# Altium schematic sheet 014_SoC GPIO 1.8V & Bootstrap.SchDoc
size 420 x 297 mm; Page Create Date: May 29, 2006; WebSite: https://www.seeedstudio.com; Page Number: 14; Drawing: qxn; Schematic Name: BeaglePlay; Page Size: A3; Comment: Seeed Title; Page Count: 22; Page Name: 014_SoC GPIO 1.8V & Bootstrap; Company: Seeed Studio; RevCode: v0.2; DsnPath: C:\Users\a0488739\Documents\GitHub\beagleplay\allegro\DVT\BEAGLEPLAYV020_220915.DSN; SchematicName: BeaglePlay; PageName: 014_SoC GPIO 1.8V & Bootstrap; PageSize: A3; TopSchematic: True
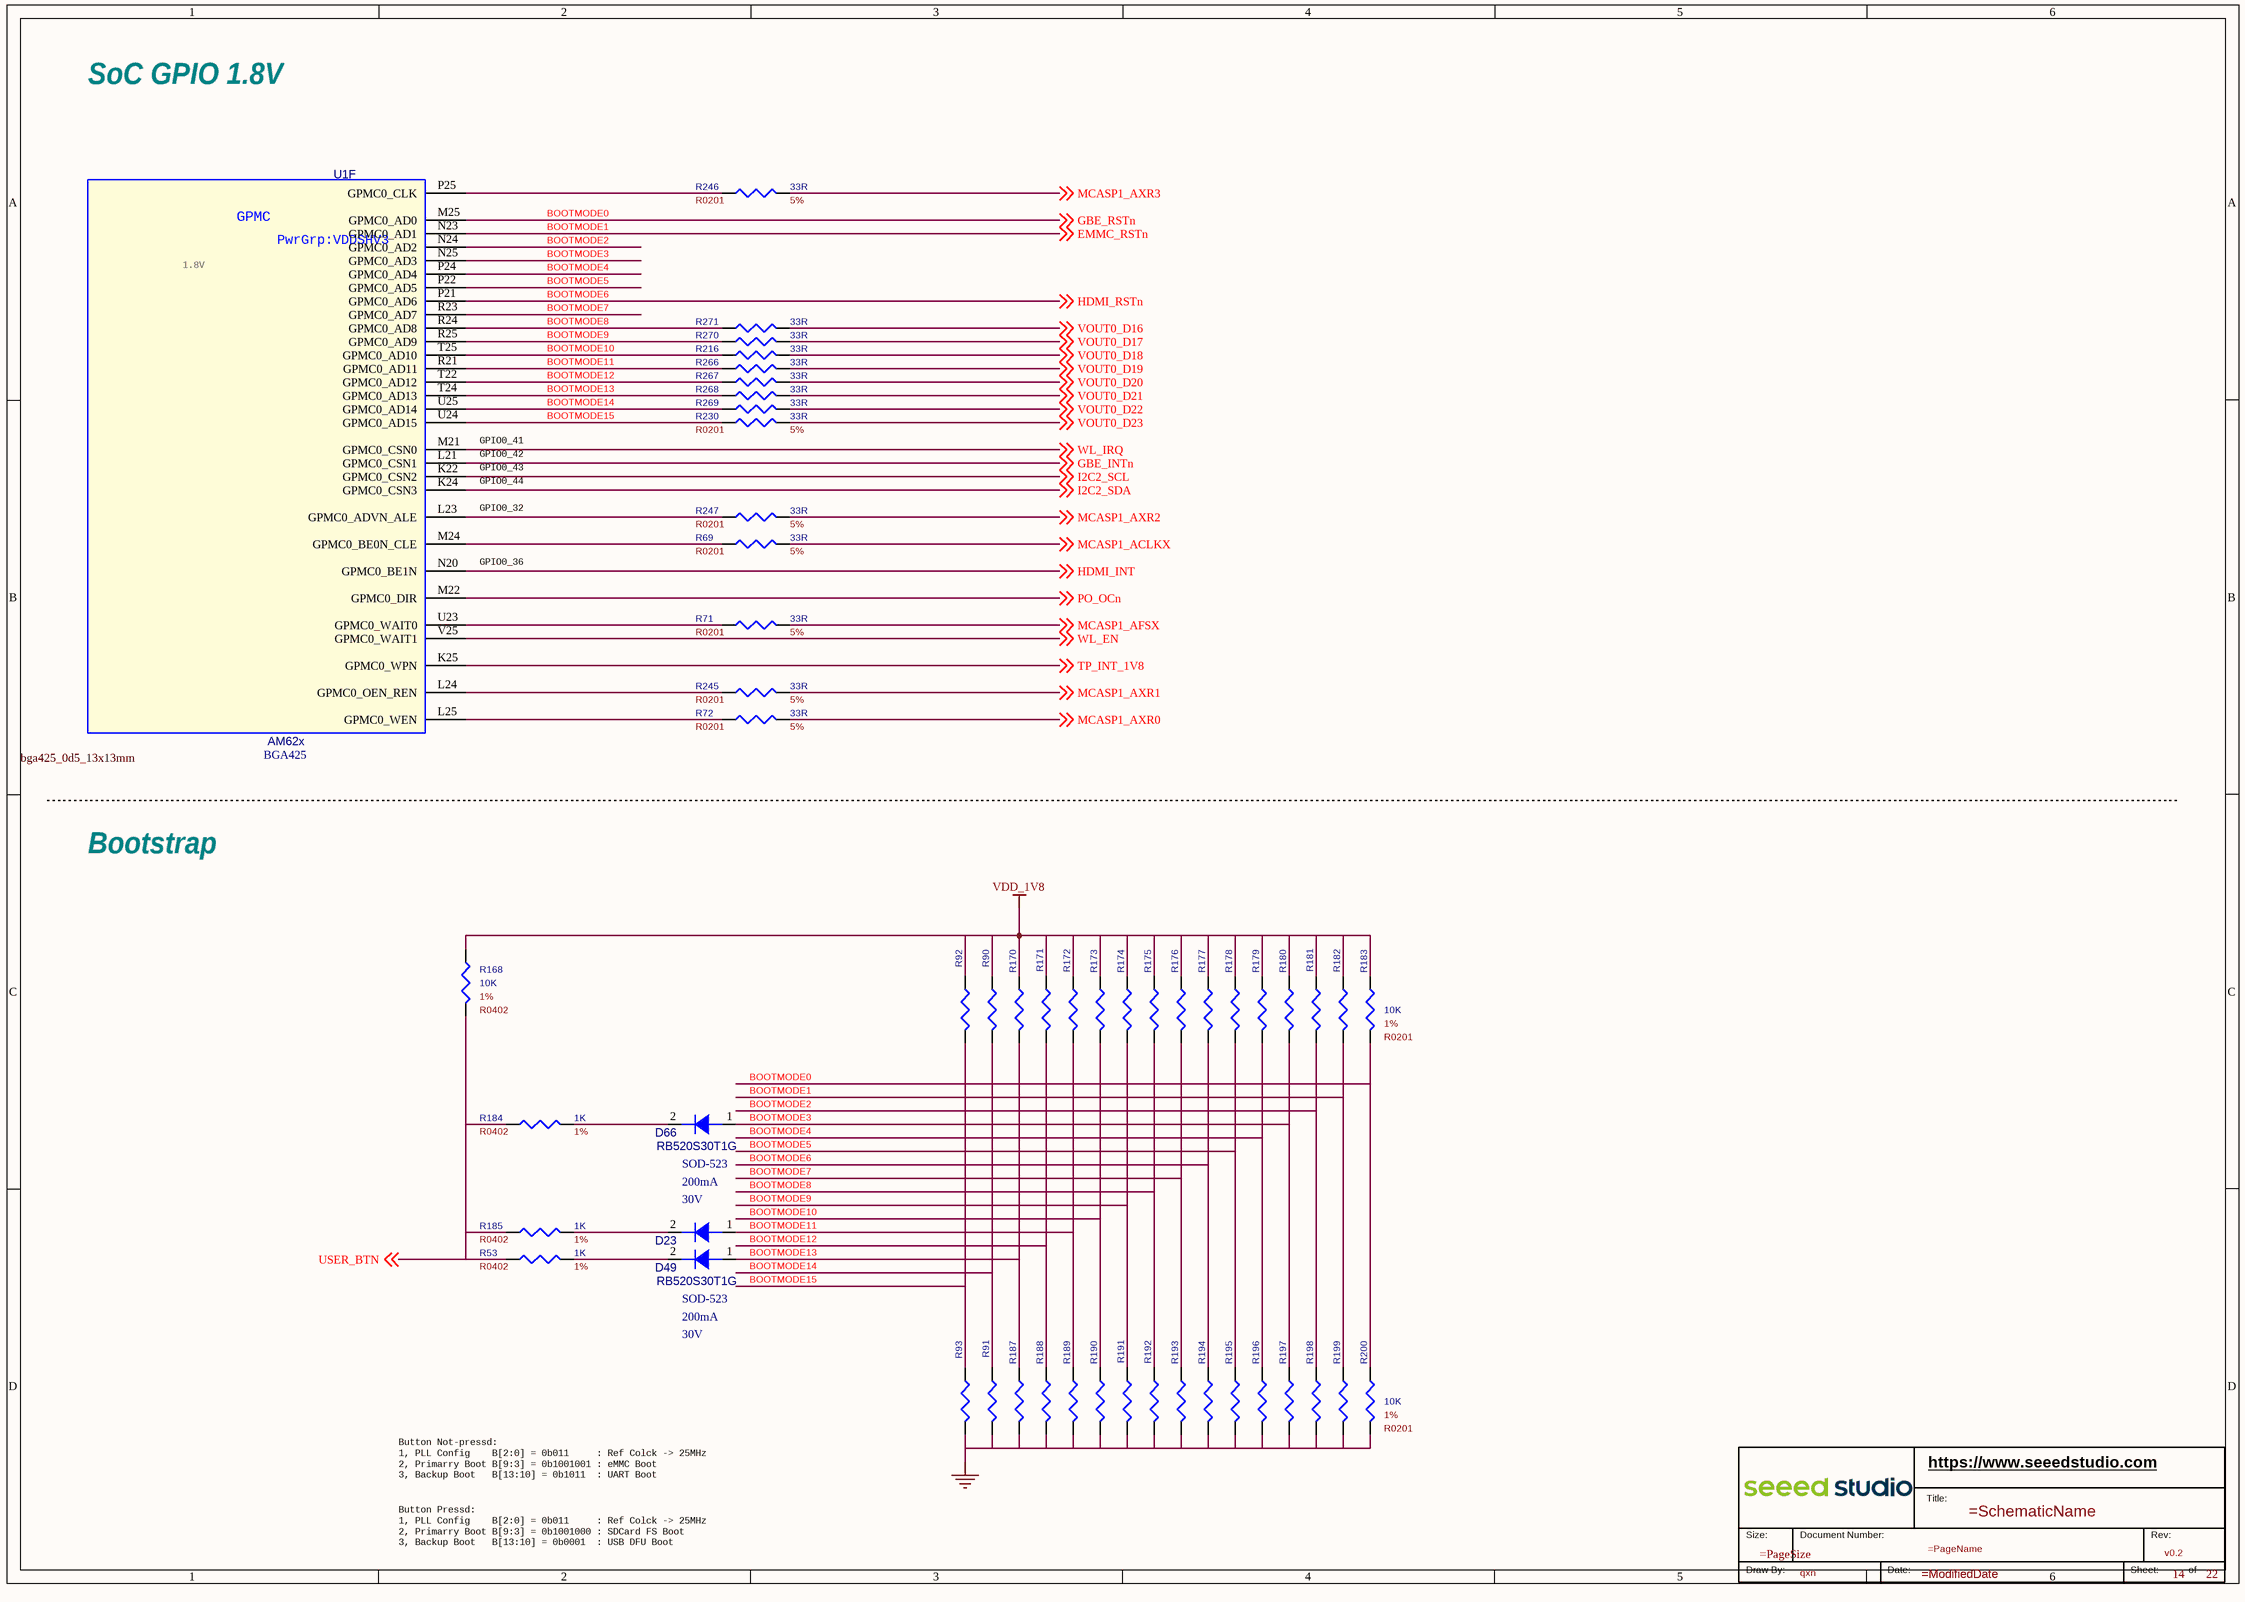
[diagram p0: 014_SoC GPIO 1.8V & Bootstrap.SchDoc]

## Parts
*  RevCode: v0.2  Page Number: 14  Page Count: 22  Drawing: qxn  (hidden comment: Seeed Title)  (graphical)
D23  D  [sod_523]  (value not drawn)
D49  value RB520S30T1G  Repetitive Reverse Voltage Maximum: 30V  Peak Forward Current: 200mA  Package Size: SOD-523  [sod_523]  (hidden comment: D)
D66  value RB520S30T1G  Repetitive Reverse Voltage Maximum: 30V  Peak Forward Current: 200mA  Package Size: SOD-523  [sod_523]  (hidden comment: D)
R53  value 1K  Rating: 1%  [R0402]  (hidden comment: R)
R69  value 33R  Rating: 5%  [R0201]  (hidden comment: R)
R71  value 33R  Rating: 5%  [R0201]  (hidden comment: R)
R72  value 33R  Rating: 5%  [R0201]  (hidden comment: R)
R90  R  [R0201]  (value not drawn)
R91  R  [R0201]  (value not drawn)
R92  R  [R0201]  (value not drawn)
R93  R  [R0201]  (value not drawn)
R168  value 10K  Rating: 1%  [R0402]  (hidden comment: R)
R170  R  [R0201]  (value not drawn)
R171  R  [R0201]  (value not drawn)
R172  R  [R0201]  (value not drawn)
R173  R  [R0201]  (value not drawn)
R174  R  [R0201]  (value not drawn)
R175  R  [R0201]  (value not drawn)
R176  R  [R0201]  (value not drawn)
R177  R  [R0201]  (value not drawn)
R178  R  [R0201]  (value not drawn)
R179  R  [R0201]  (value not drawn)
R180  R  [R0201]  (value not drawn)
R181  R  [R0201]  (value not drawn)
R182  R  [R0201]  (value not drawn)
R183  value 10K  Rating: 1%  [R0201]  (hidden comment: R)
R184  value 1K  Rating: 1%  [R0402]  (hidden comment: R)
R185  value 1K  Rating: 1%  [R0402]  (hidden comment: R)
R187  R  [R0201]  (value not drawn)
R188  R  [R0201]  (value not drawn)
R189  R  [R0201]  (value not drawn)
R190  R  [R0201]  (value not drawn)
R191  R  [R0201]  (value not drawn)
R192  R  [R0201]  (value not drawn)
R193  R  [R0201]  (value not drawn)
R194  R  [R0201]  (value not drawn)
R195  R  [R0201]  (value not drawn)
R196  R  [R0201]  (value not drawn)
R197  R  [R0201]  (value not drawn)
R198  R  [R0201]  (value not drawn)
R199  R  [R0201]  (value not drawn)
R200  value 10K  Rating: 1%  [R0201]  (hidden comment: R)
R216  value 33R  [R0201]  (hidden comment: R)
R230  value 33R  Rating: 5%  [R0201]  (hidden comment: R)
R245  value 33R  Rating: 5%  [R0201]  (hidden comment: R)
R246  value 33R  Rating: 5%  [R0201]  (hidden comment: R)
R247  value 33R  Rating: 5%  [R0201]  (hidden comment: R)
R266  value 33R  [R0201]  (hidden comment: R)
R267  value 33R  [R0201]  (hidden comment: R)
R268  value 33R  [R0201]  (hidden comment: R)
R269  value 33R  [R0201]  (hidden comment: R)
R270  value 33R  [R0201]  (hidden comment: R)
R271  value 33R  [R0201]  (hidden comment: R)
U1  value AM62x  Package Size: BGA425  [bga425_0d5_13x13mm]  (hidden comment: AM62x_BGA425)  (part F of 19)

## Nets
GND: R91.2 R93.2 R187.2 R188.2 R189.2 R190.2 R191.2 R192.2 R193.2 R194.2 R195.2 R196.2 R197.2 R198.2 R199.2 R200.2
VDD_1V8: R90.1 R92.1 R168.1 R170.1 R171.1 R172.1 R173.1 R174.1 R175.1 R176.1 R177.1 R178.1 R179.1 R180.1 R181.1 R182.1 R183.1
BOOTMODE0: R183.2 R200.1 U1.M25(GPMC0_AD0) ; off-sheet GBE_RSTn  [also labelled GBE_RSTn]
BOOTMODE1: R182.2 R199.1 U1.N23(GPMC0_AD1) ; off-sheet EMMC_RSTn  [also labelled EMMC_RSTn]
BOOTMODE2: R181.2 R198.1 U1.N24(GPMC0_AD2)
BOOTMODE3: D66.1(A) R180.2 R197.1 U1.N25(GPMC0_AD3)
BOOTMODE4: R179.2 R196.1 U1.P24(GPMC0_AD4)
BOOTMODE5: R178.2 R195.1 U1.P22(GPMC0_AD5)
BOOTMODE6: R177.2 R194.1 U1.P21(GPMC0_AD6) ; off-sheet HDMI_RSTn  [also labelled HDMI_RSTn]
BOOTMODE7: R176.2 R193.1 U1.R23(GPMC0_AD7)
BOOTMODE8: R175.2 R192.1 R271.1 U1.R24(GPMC0_AD8)
BOOTMODE9: R174.2 R191.1 R270.1 U1.R25(GPMC0_AD9)
BOOTMODE10: R173.2 R190.1 R216.1 U1.T25(GPMC0_AD10)
BOOTMODE11: D23.1(A) R172.2 R189.1 R266.1 U1.R21(GPMC0_AD11)
BOOTMODE12: R171.2 R188.1 R267.1 U1.T22(GPMC0_AD12)
BOOTMODE13: D49.1(A) R170.2 R187.1 R268.1 U1.T24(GPMC0_AD13)
BOOTMODE14: R90.2 R91.1 R269.1 U1.U25(GPMC0_AD14)
BOOTMODE15: R92.2 R93.1 R230.1 U1.U24(GPMC0_AD15)
GBE_INTn: U1.L21(GPMC0_CSN1) ; off-sheet GBE_INTn
HDMI_INT: U1.N20(GPMC0_BE1N) ; off-sheet HDMI_INT
I2C2_SCL: U1.K22(GPMC0_CSN2) ; off-sheet I2C2_SCL
I2C2_SDA: U1.K24(GPMC0_CSN3) ; off-sheet I2C2_SDA
MCASP1_ACLKX: R69.2 ; off-sheet MCASP1_ACLKX
MCASP1_AFSX: R71.2 ; off-sheet MCASP1_AFSX
MCASP1_AXR0: R72.2 ; off-sheet MCASP1_AXR0
MCASP1_AXR1: R245.2 ; off-sheet MCASP1_AXR1
MCASP1_AXR2: R247.2 ; off-sheet MCASP1_AXR2
MCASP1_AXR3: R246.2 ; off-sheet MCASP1_AXR3
PO_OCn: U1.M22(GPMC0_DIR) ; off-sheet PO_OCn
TP_INT_1V8: U1.K25(GPMC0_WPN) ; off-sheet TP_INT_1V8
USER_BTN: R53.1 R168.2 R184.1 R185.1 ; off-sheet USER_BTN
VOUT0_D16: R271.2 ; off-sheet VOUT0_D16
VOUT0_D17: R270.2 ; off-sheet VOUT0_D17
VOUT0_D18: R216.2 ; off-sheet VOUT0_D18
VOUT0_D19: R266.2 ; off-sheet VOUT0_D19
VOUT0_D20: R267.2 ; off-sheet VOUT0_D20
VOUT0_D21: R268.2 ; off-sheet VOUT0_D21
VOUT0_D22: R269.2 ; off-sheet VOUT0_D22
VOUT0_D23: R230.2 ; off-sheet VOUT0_D23
WL_EN: U1.V25(GPMC0_WAIT1) ; off-sheet WL_EN
WL_IRQ: U1.M21(GPMC0_CSN0) ; off-sheet WL_IRQ
NetD23_2: D23.2(C) R185.2
NetD49_2: D49.2(C) R53.2
NetD66_2: D66.2(C) R184.2
NetR69_1: R69.1 U1.M24(GPMC0_BE0N_CLE)
NetR71_1: R71.1 U1.U23(GPMC0_WAIT0)
NetR72_1: R72.1 U1.L25(GPMC0_WEN)
NetR245_1: R245.1 U1.L24(GPMC0_OEN_REN)
NetR246_1: R246.1 U1.P25(GPMC0_CLK)
NetR247_1: R247.1 U1.L23(GPMC0_ADVN_ALE)

## Notes on the sheet
- SoC GPIO 1.8V
- 1.8V
- GPIO0_42
- GPIO0_41
- GPIO0_43
- GPIO0_44
- GPIO0_32
- GPIO0_36
- Bootstrap
- Button Not-pressd:
  1, PLL Config    B[2:0] = 0b011     : Ref Colck -> 25MHz
  2, Primarry Boot B[9:3] = 0b1001001 : eMMC Boot
  3, Backup Boot   B[13:10] = 0b1011  : UART Boot
- Button Pressd:
  1, PLL Config    B[2:0] = 0b011     : Ref Colck -> 25MHz
  2, Primarry Boot B[9:3] = 0b1001000 : SDCard FS Boot
  3, Backup Boot   B[13:10] = 0b0001  : USB DFU Boot
- (in symbol AM62x_BGA425, part F) GPMC; PwrGrp:VDDSHV3
- (in symbol Seeed Title) https://www.seeedstudio.com; Title:; Size:; Document Number:; Rev:; Draw By:; Date:; Sheet:; of

## Library data of the parts
* = Seeed Title: Company: Seeed Studio; WebSite: https://www.seeedstudio.com; Schematic Name: =SchematicName; Page Size: =PageSize; Page Name: =PageName; Page Create Date: May 29, 2006; Page Modify Date: =ModifiedDate
D23 = D: DIO, Schottky, RB520S30T1G, , , , SOD-523; Part Reference: D23; Company Part Status: SCG Vehicle Device; Manufacturer: ON; PN: 304020782; Peak Forward Current: 200mA; Repetitive Reverse Voltage Maximum: 30V; CLASS: DISCRETE; PCB Footprint: sod_523; Value: RB520S30T1G; Package Size: SOD-523; Manufacturer PN: RB520S30T1G
D49 = D: DIO, Schottky, RB520S30T1G, , , , SOD-523; Part Reference: D49; Manufacturer: ON; Company Part Status: SCG Vehicle Device; CLASS: DISCRETE; PN: 304020782; PCB Footprint: sod_523; Manufacturer PN: RB520S30T1G
D66 = D: DIO, Schottky, RB520S30T1G, , , , SOD-523; Part Reference: D66; Manufacturer: ON; Company Part Status: SCG Vehicle Device; CLASS: DISCRETE; PN: 304020782; PCB Footprint: sod_523; Manufacturer PN: RB520S30T1G
R53 = R: RES, Thick Film, 1K, 1%, 1/16W, SMD, 0402; Part Reference: R53; Manufacturer PN: RC0402FR-071KL; Manufacturer: YAGEO; Company Part Status: Combox Pro; CLASS: DISCRETE; PN: 301010044; PCB Footprint: R0402; Rated Power: 1/16W; Package Size: 0402
R69 = R: RES, Thick Film, 33R, 5%, 1/20W, SMD, 0201; Part Reference: R69; Manufacturer PN: RC0201JR-0733RL; Manufacturer: YAGEO; Company Part Status: BeagleBone Carrier Board; CLASS: DISCRETE; PN: 301010675; PCB Footprint: R0201; Rated Power: 1/20W; Package Size: 0201
R71 = R: RES, Thick Film, 33R, 5%, 1/20W, SMD, 0201; Part Reference: R71; Manufacturer PN: RC0201JR-0733RL; Manufacturer: YAGEO; Company Part Status: BeagleBone Carrier Board; CLASS: DISCRETE; PN: 301010675; PCB Footprint: R0201; Rated Power: 1/20W; Package Size: 0201
R72 = R: RES, Thick Film, 33R, 5%, 1/20W, SMD, 0201; Part Reference: R72; Manufacturer PN: RC0201JR-0733RL; Manufacturer: YAGEO; Company Part Status: BeagleBone Carrier Board; CLASS: DISCRETE; PN: 301010675; PCB Footprint: R0201; Rated Power: 1/20W; Package Size: 0201
R90 = R: RES, Thick Film, 10K, 1%, 1/20W, SMD, 0201; Part Reference: R90; Manufacturer PN: RC0201FR-0710KL; Manufacturer: YAGEO; Company Part Status: RV PI; CLASS: DISCRETE; PN: 301010526; Rating: 1%; PCB Footprint: R0201; Value: 10K; Package Size: 0201; Rated Power: 1/20W
R91 = R: RES, Thick Film, 10K, 1%, 1/20W, SMD, 0201; Part Reference: R91; Company Part Status: RV PI; Manufacturer: YAGEO; Manufacturer PN: RC0201FR-0710KL; PN: 301010526; CLASS: DISCRETE; Rating: 1%; PCB Footprint: R0201; Value: 10K; Package Size: 0201; Rated Power: 1/20W
R92 = R: RES, Thick Film, 10K, 1%, 1/20W, SMD, 0201; Part Reference: R92; Company Part Status: RV PI; Manufacturer: YAGEO; Manufacturer PN: RC0201FR-0710KL; PN: 301010526; CLASS: DISCRETE; Rating: 1%; PCB Footprint: R0201; Value: 10K; Rated Power: 1/20W; Package Size: 0201
R93 = R: RES, Thick Film, 10K, 1%, 1/20W, SMD, 0201; Part Reference: R93; Manufacturer PN: RC0201FR-0710KL; Manufacturer: YAGEO; Company Part Status: RV PI; CLASS: DISCRETE; PN: 301010526; Rating: 1%; PCB Footprint: R0201; Value: 10K; Rated Power: 1/20W; Package Size: 0201
R168 = R: RES, Thick Film, 10K, 1%, 1/16W, SMD, 0402; Part Reference: R168; Company Part Status: BeagleBone Carrier Board; Manufacturer: YAGEO; Manufacturer PN: RC0402FR-0710KL; PN: 301010047; CLASS: DISCRETE; PCB Footprint: R0402; Package Size: 0402; Rated Power: 1/16W
R170 = R: RES, Thick Film, 10K, 1%, 1/20W, SMD, 0201; Part Reference: R170; Manufacturer PN: RC0201FR-0710KL; Manufacturer: YAGEO; Company Part Status: RV PI; CLASS: DISCRETE; PN: 301010526; Rating: 1%; PCB Footprint: R0201; Value: 10K; Package Size: 0201; Rated Power: 1/20W
R171 = R: RES, Thick Film, 10K, 1%, 1/20W, SMD, 0201; Part Reference: R171; Manufacturer PN: RC0201FR-0710KL; Manufacturer: YAGEO; Company Part Status: RV PI; CLASS: DISCRETE; PN: 301010526; Rating: 1%; PCB Footprint: R0201; Value: 10K; Package Size: 0201; Rated Power: 1/20W
R172 = R: RES, Thick Film, 10K, 1%, 1/20W, SMD, 0201; Part Reference: R172; Manufacturer PN: RC0201FR-0710KL; Manufacturer: YAGEO; Company Part Status: RV PI; CLASS: DISCRETE; PN: 301010526; Rating: 1%; PCB Footprint: R0201; Value: 10K; Package Size: 0201; Rated Power: 1/20W
R173 = R: RES, Thick Film, 10K, 1%, 1/20W, SMD, 0201; Part Reference: R173; Manufacturer PN: RC0201FR-0710KL; Manufacturer: YAGEO; Company Part Status: RV PI; CLASS: DISCRETE; PN: 301010526; Rating: 1%; PCB Footprint: R0201; Value: 10K; Package Size: 0201; Rated Power: 1/20W
R174 = R: RES, Thick Film, 10K, 1%, 1/20W, SMD, 0201; Part Reference: R174; Manufacturer PN: RC0201FR-0710KL; Manufacturer: YAGEO; Company Part Status: RV PI; CLASS: DISCRETE; PN: 301010526; Rating: 1%; PCB Footprint: R0201; Value: 10K; Package Size: 0201; Rated Power: 1/20W
R175 = R: RES, Thick Film, 10K, 1%, 1/20W, SMD, 0201; Part Reference: R175; Manufacturer PN: RC0201FR-0710KL; Manufacturer: YAGEO; Company Part Status: RV PI; CLASS: DISCRETE; PN: 301010526; Rating: 1%; PCB Footprint: R0201; Value: 10K; Package Size: 0201; Rated Power: 1/20W
R176 = R: RES, Thick Film, 10K, 1%, 1/20W, SMD, 0201; Part Reference: R176; Manufacturer PN: RC0201FR-0710KL; Manufacturer: YAGEO; Company Part Status: RV PI; CLASS: DISCRETE; PN: 301010526; Rating: 1%; PCB Footprint: R0201; Value: 10K; Package Size: 0201; Rated Power: 1/20W
R177 = R: RES, Thick Film, 10K, 1%, 1/20W, SMD, 0201; Part Reference: R177; Manufacturer PN: RC0201FR-0710KL; Manufacturer: YAGEO; Company Part Status: RV PI; CLASS: DISCRETE; PN: 301010526; Rating: 1%; PCB Footprint: R0201; Value: 10K; Package Size: 0201; Rated Power: 1/20W
R178 = R: RES, Thick Film, 10K, 1%, 1/20W, SMD, 0201; Part Reference: R178; Manufacturer PN: RC0201FR-0710KL; Manufacturer: YAGEO; Company Part Status: RV PI; CLASS: DISCRETE; PN: 301010526; Rating: 1%; PCB Footprint: R0201; Value: 10K; Package Size: 0201; Rated Power: 1/20W
R179 = R: RES, Thick Film, 10K, 1%, 1/20W, SMD, 0201; Part Reference: R179; Manufacturer PN: RC0201FR-0710KL; Manufacturer: YAGEO; Company Part Status: RV PI; CLASS: DISCRETE; PN: 301010526; Rating: 1%; PCB Footprint: R0201; Value: 10K; Package Size: 0201; Rated Power: 1/20W
R180 = R: RES, Thick Film, 10K, 1%, 1/20W, SMD, 0201; Part Reference: R180; Manufacturer PN: RC0201FR-0710KL; Manufacturer: YAGEO; Company Part Status: RV PI; CLASS: DISCRETE; PN: 301010526; Rating: 1%; PCB Footprint: R0201; Value: 10K; Package Size: 0201; Rated Power: 1/20W
R181 = R: RES, Thick Film, 10K, 1%, 1/20W, SMD, 0201; Part Reference: R181; Manufacturer PN: RC0201FR-0710KL; Manufacturer: YAGEO; Company Part Status: RV PI; CLASS: DISCRETE; PN: 301010526; Rating: 1%; PCB Footprint: R0201; Value: 10K; Package Size: 0201; Rated Power: 1/20W
R182 = R: RES, Thick Film, 10K, 1%, 1/20W, SMD, 0201; Part Reference: R182; Manufacturer PN: RC0201FR-0710KL; Manufacturer: YAGEO; Company Part Status: RV PI; CLASS: DISCRETE; PN: 301010526; Rating: 1%; PCB Footprint: R0201; Value: 10K; Package Size: 0201; Rated Power: 1/20W
R183 = R: RES, Thick Film, 10K, 1%, 1/20W, SMD, 0201; Part Reference: R183; Company Part Status: RV PI; Manufacturer: YAGEO; Manufacturer PN: RC0201FR-0710KL; PN: 301010526; CLASS: DISCRETE; PCB Footprint: R0201; Package Size: 0201; Rated Power: 1/20W
R184 = R: RES, Thick Film, 1K, 1%, 1/16W, SMD, 0402; Part Reference: R184; Manufacturer PN: RC0402FR-071KL; Manufacturer: YAGEO; Company Part Status: Combox Pro; CLASS: DISCRETE; PN: 301010044; PCB Footprint: R0402; Rated Power: 1/16W; Package Size: 0402
R185 = R: RES, Thick Film, 1K, 1%, 1/16W, SMD, 0402; Part Reference: R185; Manufacturer PN: RC0402FR-071KL; Manufacturer: YAGEO; Company Part Status: Combox Pro; CLASS: DISCRETE; PN: 301010044; PCB Footprint: R0402; Rated Power: 1/16W; Package Size: 0402
R187 = R: RES, Thick Film, 10K, 1%, 1/20W, SMD, 0201; Part Reference: R187; Company Part Status: RV PI; Manufacturer: YAGEO; Manufacturer PN: RC0201FR-0710KL; PN: 301010526; CLASS: DISCRETE; Rating: 1%; PCB Footprint: R0201; Value: 10K; Package Size: 0201; Rated Power: 1/20W
R188 = R: RES, Thick Film, 10K, 1%, 1/20W, SMD, 0201; Part Reference: R188; Company Part Status: RV PI; Manufacturer: YAGEO; Manufacturer PN: RC0201FR-0710KL; PN: 301010526; CLASS: DISCRETE; Rating: 1%; PCB Footprint: R0201; Value: 10K; Package Size: 0201; Rated Power: 1/20W
R189 = R: RES, Thick Film, 10K, 1%, 1/20W, SMD, 0201; Part Reference: R189; Company Part Status: RV PI; Manufacturer: YAGEO; Manufacturer PN: RC0201FR-0710KL; PN: 301010526; CLASS: DISCRETE; Rating: 1%; PCB Footprint: R0201; Value: 10K; Package Size: 0201; Rated Power: 1/20W
R190 = R: RES, Thick Film, 10K, 1%, 1/20W, SMD, 0201; Part Reference: R190; Company Part Status: RV PI; Manufacturer: YAGEO; Manufacturer PN: RC0201FR-0710KL; PN: 301010526; CLASS: DISCRETE; Rating: 1%; PCB Footprint: R0201; Value: 10K; Package Size: 0201; Rated Power: 1/20W
R191 = R: RES, Thick Film, 10K, 1%, 1/20W, SMD, 0201; Part Reference: R191; Company Part Status: RV PI; Manufacturer: YAGEO; Manufacturer PN: RC0201FR-0710KL; PN: 301010526; CLASS: DISCRETE; Rating: 1%; PCB Footprint: R0201; Value: 10K; Package Size: 0201; Rated Power: 1/20W
R192 = R: RES, Thick Film, 10K, 1%, 1/20W, SMD, 0201; Part Reference: R192; Company Part Status: RV PI; Manufacturer: YAGEO; Manufacturer PN: RC0201FR-0710KL; PN: 301010526; CLASS: DISCRETE; Rating: 1%; PCB Footprint: R0201; Value: 10K; Package Size: 0201; Rated Power: 1/20W
R193 = R: RES, Thick Film, 10K, 1%, 1/20W, SMD, 0201; Part Reference: R193; Company Part Status: RV PI; Manufacturer: YAGEO; Manufacturer PN: RC0201FR-0710KL; PN: 301010526; CLASS: DISCRETE; Rating: 1%; PCB Footprint: R0201; Value: 10K; Package Size: 0201; Rated Power: 1/20W
R194 = R: RES, Thick Film, 10K, 1%, 1/20W, SMD, 0201; Part Reference: R194; Company Part Status: RV PI; Manufacturer: YAGEO; Manufacturer PN: RC0201FR-0710KL; PN: 301010526; CLASS: DISCRETE; Rating: 1%; PCB Footprint: R0201; Value: 10K; Package Size: 0201; Rated Power: 1/20W
R195 = R: RES, Thick Film, 10K, 1%, 1/20W, SMD, 0201; Part Reference: R195; Company Part Status: RV PI; Manufacturer: YAGEO; Manufacturer PN: RC0201FR-0710KL; PN: 301010526; CLASS: DISCRETE; Rating: 1%; PCB Footprint: R0201; Value: 10K; Package Size: 0201; Rated Power: 1/20W
R196 = R: RES, Thick Film, 10K, 1%, 1/20W, SMD, 0201; Part Reference: R196; Company Part Status: RV PI; Manufacturer: YAGEO; Manufacturer PN: RC0201FR-0710KL; PN: 301010526; CLASS: DISCRETE; Rating: 1%; PCB Footprint: R0201; Value: 10K; Package Size: 0201; Rated Power: 1/20W
R197 = R: RES, Thick Film, 10K, 1%, 1/20W, SMD, 0201; Part Reference: R197; Company Part Status: RV PI; Manufacturer: YAGEO; Manufacturer PN: RC0201FR-0710KL; PN: 301010526; CLASS: DISCRETE; Rating: 1%; PCB Footprint: R0201; Value: 10K; Package Size: 0201; Rated Power: 1/20W
R198 = R: RES, Thick Film, 10K, 1%, 1/20W, SMD, 0201; Part Reference: R198; Company Part Status: RV PI; Manufacturer: YAGEO; Manufacturer PN: RC0201FR-0710KL; PN: 301010526; CLASS: DISCRETE; Rating: 1%; PCB Footprint: R0201; Value: 10K; Package Size: 0201; Rated Power: 1/20W
R199 = R: RES, Thick Film, 10K, 1%, 1/20W, SMD, 0201; Part Reference: R199; Company Part Status: RV PI; Manufacturer: YAGEO; Manufacturer PN: RC0201FR-0710KL; PN: 301010526; CLASS: DISCRETE; Rating: 1%; PCB Footprint: R0201; Value: 10K; Package Size: 0201; Rated Power: 1/20W
R200 = R: RES, Thick Film, 10K, 1%, 1/20W, SMD, 0201; Part Reference: R200; Manufacturer PN: RC0201FR-0710KL; Manufacturer: YAGEO; Company Part Status: RV PI; CLASS: DISCRETE; PN: 301010526; PCB Footprint: R0201; Package Size: 0201; Rated Power: 1/20W
R216 = R: RES, Thick Film, 33R, 5%, 1/20W, SMD, 0201; Part Reference: R216; Manufacturer PN: RC0201JR-0733RL; Manufacturer: YAGEO; Company Part Status: BeagleBone Carrier Board; CLASS: DISCRETE; PN: 301010675; Rating: 5%; PCB Footprint: R0201; Rated Power: 1/20W; Package Size: 0201
R230 = R: RES, Thick Film, 33R, 5%, 1/20W, SMD, 0201; Part Reference: R230; Manufacturer PN: RC0201JR-0733RL; Manufacturer: YAGEO; Company Part Status: BeagleBone Carrier Board; CLASS: DISCRETE; PN: 301010675; PCB Footprint: R0201; Rated Power: 1/20W; Package Size: 0201
R245 = R: RES, Thick Film, 33R, 5%, 1/20W, SMD, 0201; Part Reference: R245; Manufacturer PN: RC0201JR-0733RL; Manufacturer: YAGEO; Company Part Status: BeagleBone Carrier Board; CLASS: DISCRETE; PN: 301010675; PCB Footprint: R0201; Rated Power: 1/20W; Package Size: 0201
R246 = R: RES, Thick Film, 33R, 5%, 1/20W, SMD, 0201; Part Reference: R246; Manufacturer PN: RC0201JR-0733RL; Manufacturer: YAGEO; Company Part Status: BeagleBone Carrier Board; CLASS: DISCRETE; PN: 301010675; PCB Footprint: R0201; Rated Power: 1/20W; Package Size: 0201
R247 = R: RES, Thick Film, 33R, 5%, 1/20W, SMD, 0201; Part Reference: R247; Manufacturer PN: RC0201JR-0733RL; Manufacturer: YAGEO; Company Part Status: BeagleBone Carrier Board; CLASS: DISCRETE; PN: 301010675; PCB Footprint: R0201; Rated Power: 1/20W; Package Size: 0201
R266 = R: RES, Thick Film, 33R, 5%, 1/20W, SMD, 0201; Part Reference: R266; Manufacturer PN: RC0201JR-0733RL; Manufacturer: YAGEO; Company Part Status: BeagleBone Carrier Board; CLASS: DISCRETE; PN: 301010675; Rating: 5%; PCB Footprint: R0201; Rated Power: 1/20W; Package Size: 0201
R267 = R: RES, Thick Film, 33R, 5%, 1/20W, SMD, 0201; Part Reference: R267; Manufacturer PN: RC0201JR-0733RL; Manufacturer: YAGEO; Company Part Status: BeagleBone Carrier Board; CLASS: DISCRETE; PN: 301010675; Rating: 5%; PCB Footprint: R0201; Rated Power: 1/20W; Package Size: 0201
R268 = R: RES, Thick Film, 33R, 5%, 1/20W, SMD, 0201; Part Reference: R268; Manufacturer PN: RC0201JR-0733RL; Manufacturer: YAGEO; Company Part Status: BeagleBone Carrier Board; CLASS: DISCRETE; PN: 301010675; Rating: 5%; PCB Footprint: R0201; Rated Power: 1/20W; Package Size: 0201
R269 = R: RES, Thick Film, 33R, 5%, 1/20W, SMD, 0201; Part Reference: R269; Manufacturer PN: RC0201JR-0733RL; Manufacturer: YAGEO; Company Part Status: BeagleBone Carrier Board; CLASS: DISCRETE; PN: 301010675; Rating: 5%; PCB Footprint: R0201; Rated Power: 1/20W; Package Size: 0201
R270 = R: RES, Thick Film, 33R, 5%, 1/20W, SMD, 0201; Part Reference: R270; Manufacturer PN: RC0201JR-0733RL; Manufacturer: YAGEO; Company Part Status: BeagleBone Carrier Board; CLASS: DISCRETE; PN: 301010675; Rating: 5%; PCB Footprint: R0201; Rated Power: 1/20W; Package Size: 0201
R271 = R: RES, Thick Film, 33R, 5%, 1/20W, SMD, 0201; Part Reference: R271; Manufacturer PN: RC0201JR-0733RL; Manufacturer: YAGEO; Company Part Status: BeagleBone Carrier Board; CLASS: DISCRETE; PN: 301010675; Rating: 5%; PCB Footprint: R0201; Rated Power: 1/20W; Package Size: 0201
U1 = AM62x_BGA425: IC, Controller, MPU, AM62x, BGA425; Part Reference: U1; Company Part Status: BeaglePlay; Manufacturer: TI; Manufacturer PN: AM6254ATCGGHALWR; PN: 310011537; PCB Footprint: bga425_0d5_13x13mm; CLASS: IC